# Altium schematic sheet LogicShifters_Schematic.SchDoc
size A3; SheetNumber: 2; SheetTotal: 3
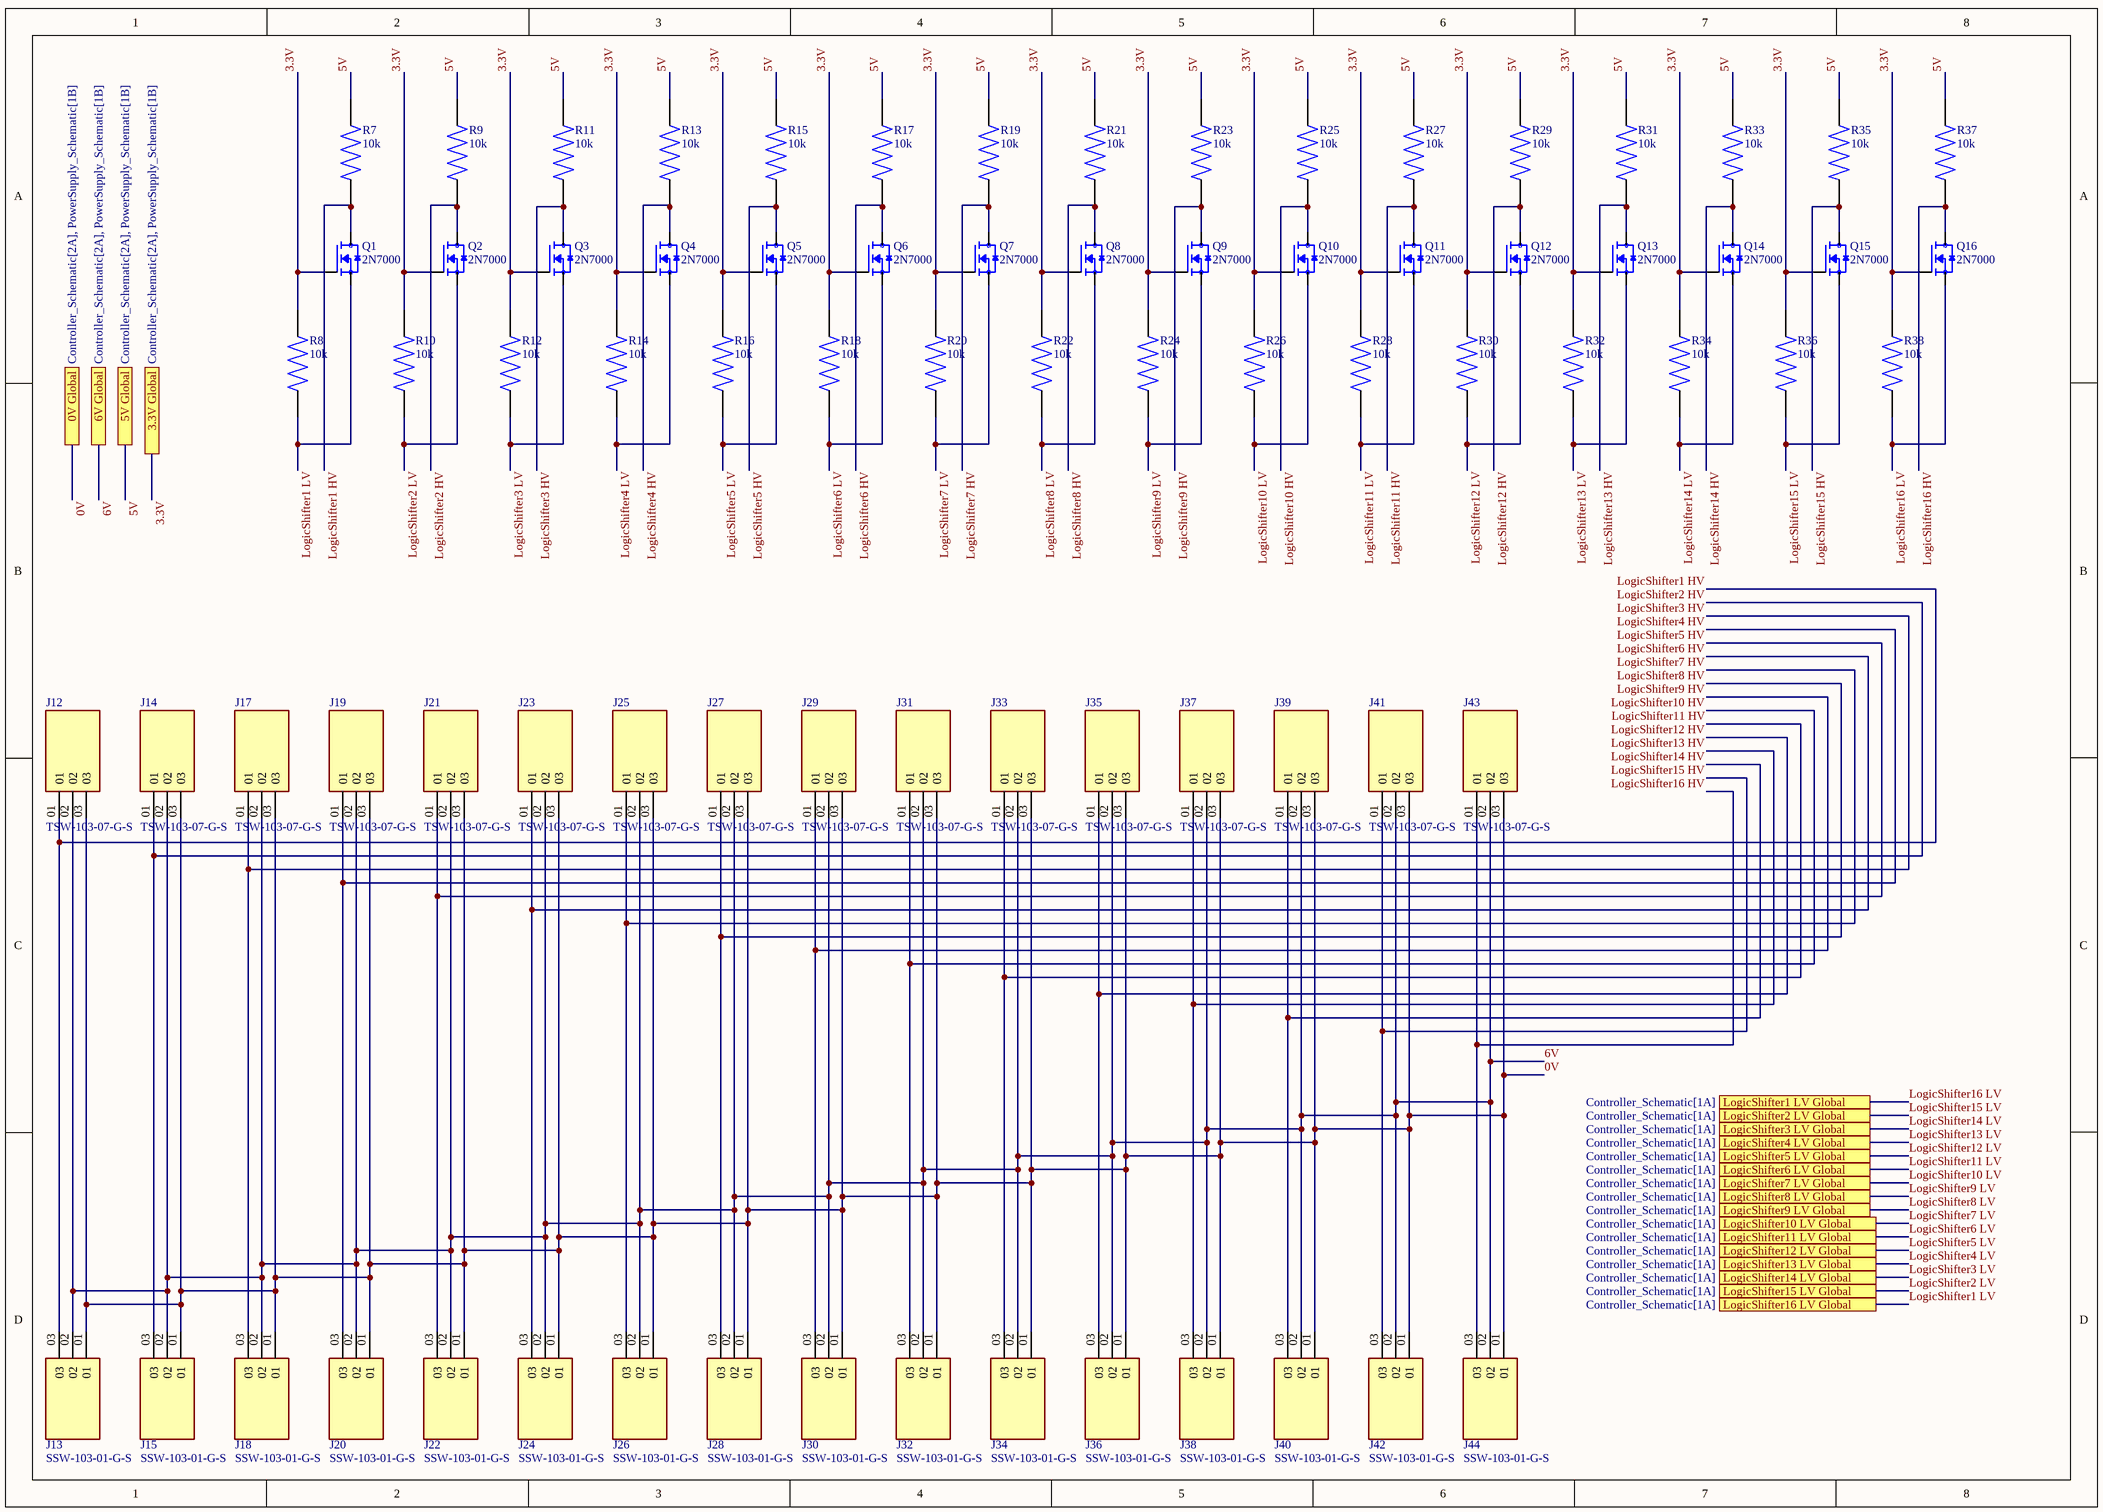
[diagram p0: LogicShifters_Schematic.SchDoc]

## Parts
J12  TSW-103-07-G-S  [SAMTEC_TSW-103-07-G-S]
J13  SSW-103-01-G-S  [SAMTEC_SSW-103-01-G-S]
J14  TSW-103-07-G-S  [SAMTEC_TSW-103-07-G-S]
J15  SSW-103-01-G-S  [SAMTEC_SSW-103-01-G-S]
J17  TSW-103-07-G-S  [SAMTEC_TSW-103-07-G-S]
J18  SSW-103-01-G-S  [SAMTEC_SSW-103-01-G-S]
J19  TSW-103-07-G-S  [SAMTEC_TSW-103-07-G-S]
J20  SSW-103-01-G-S  [SAMTEC_SSW-103-01-G-S]
J21  TSW-103-07-G-S  [SAMTEC_TSW-103-07-G-S]
J22  SSW-103-01-G-S  [SAMTEC_SSW-103-01-G-S]
J23  TSW-103-07-G-S  [SAMTEC_TSW-103-07-G-S]
J24  SSW-103-01-G-S  [SAMTEC_SSW-103-01-G-S]
J25  TSW-103-07-G-S  [SAMTEC_TSW-103-07-G-S]
J26  SSW-103-01-G-S  [SAMTEC_SSW-103-01-G-S]
J27  TSW-103-07-G-S  [SAMTEC_TSW-103-07-G-S]
J28  SSW-103-01-G-S  [SAMTEC_SSW-103-01-G-S]
J29  TSW-103-07-G-S  [SAMTEC_TSW-103-07-G-S]
J30  SSW-103-01-G-S  [SAMTEC_SSW-103-01-G-S]
J31  TSW-103-07-G-S  [SAMTEC_TSW-103-07-G-S]
J32  SSW-103-01-G-S  [SAMTEC_SSW-103-01-G-S]
J33  TSW-103-07-G-S  [SAMTEC_TSW-103-07-G-S]
J34  SSW-103-01-G-S  [SAMTEC_SSW-103-01-G-S]
J35  TSW-103-07-G-S  [SAMTEC_TSW-103-07-G-S]
J36  SSW-103-01-G-S  [SAMTEC_SSW-103-01-G-S]
J37  TSW-103-07-G-S  [SAMTEC_TSW-103-07-G-S]
J38  SSW-103-01-G-S  [SAMTEC_SSW-103-01-G-S]
J39  TSW-103-07-G-S  [SAMTEC_TSW-103-07-G-S]
J40  SSW-103-01-G-S  [SAMTEC_SSW-103-01-G-S]
J41  TSW-103-07-G-S  [SAMTEC_TSW-103-07-G-S]
J42  SSW-103-01-G-S  [SAMTEC_SSW-103-01-G-S]
J43  TSW-103-07-G-S  [SAMTEC_TSW-103-07-G-S]
J44  SSW-103-01-G-S  [SAMTEC_SSW-103-01-G-S]
Q1  2N7000  [TO92254P458H750-3]
Q2  2N7000  [TO92254P458H750-3]
Q3  2N7000  [TO92254P458H750-3]
Q4  2N7000  [TO92254P458H750-3]
Q5  2N7000  [TO92254P458H750-3]
Q6  2N7000  [TO92254P458H750-3]
Q7  2N7000  [TO92254P458H750-3]
Q8  2N7000  [TO92254P458H750-3]
Q9  2N7000  [TO92254P458H750-3]
Q10  2N7000  [TO92254P458H750-3]
Q11  2N7000  [TO92254P458H750-3]
Q12  2N7000  [TO92254P458H750-3]
Q13  2N7000  [TO92254P458H750-3]
Q14  2N7000  [TO92254P458H750-3]
Q15  2N7000  [TO92254P458H750-3]
Q16  2N7000  [TO92254P458H750-3]
R7  10k  [RESAD700W45L350D185]
R8  10k  [RESAD700W45L350D185]
R9  10k  [RESAD700W45L350D185]
R10  10k  [RESAD700W45L350D185]
R11  10k  [RESAD700W45L350D185]
R12  10k  [RESAD700W45L350D185]
R13  10k  [RESAD700W45L350D185]
R14  10k  [RESAD700W45L350D185]
R15  10k  [RESAD700W45L350D185]
R16  10k  [RESAD700W45L350D185]
R17  10k  [RESAD700W45L350D185]
R18  10k  [RESAD700W45L350D185]
R19  10k  [RESAD700W45L350D185]
R20  10k  [RESAD700W45L350D185]
R21  10k  [RESAD700W45L350D185]
R22  10k  [RESAD700W45L350D185]
R23  10k  [RESAD700W45L350D185]
R24  10k  [RESAD700W45L350D185]
R25  10k  [RESAD700W45L350D185]
R26  10k  [RESAD700W45L350D185]
R27  10k  [RESAD700W45L350D185]
R28  10k  [RESAD700W45L350D185]
R29  10k  [RESAD700W45L350D185]
R30  10k  [RESAD700W45L350D185]
R31  10k  [RESAD700W45L350D185]
R32  10k  [RESAD700W45L350D185]
R33  10k  [RESAD700W45L350D185]
R34  10k  [RESAD700W45L350D185]
R35  10k  [RESAD700W45L350D185]
R36  10k  [RESAD700W45L350D185]
R37  10k  [RESAD700W45L350D185]
R38  10k  [RESAD700W45L350D185]

## Ports
0V Global (see Controller_Schematic[2A], PowerSupply_Schematic[1B]), 3.3V Global (see Controller_Schematic[2A], PowerSupply_Schematic[1B]), 5V Global (see Controller_Schematic[2A], PowerSupply_Schematic[1B]), 6V Global (see Controller_Schematic[2A], PowerSupply_Schematic[1B]), LogicShifter1 LV Global (see Controller_Schematic[1A]), LogicShifter2 LV Global (see Controller_Schematic[1A]), LogicShifter3 LV Global (see Controller_Schematic[1A]), LogicShifter4 LV Global (see Controller_Schematic[1A]), LogicShifter5 LV Global (see Controller_Schematic[1A]), LogicShifter6 LV Global (see Controller_Schematic[1A]), LogicShifter7 LV Global (see Controller_Schematic[1A]), LogicShifter8 LV Global (see Controller_Schematic[1A]), LogicShifter9 LV Global (see Controller_Schematic[1A]), LogicShifter10 LV Global (see Controller_Schematic[1A]), LogicShifter11 LV Global (see Controller_Schematic[1A]), LogicShifter12 LV Global (see Controller_Schematic[1A]), LogicShifter13 LV Global (see Controller_Schematic[1A]), LogicShifter14 LV Global (see Controller_Schematic[1A]), LogicShifter15 LV Global (see Controller_Schematic[1A]), LogicShifter16 LV Global (see Controller_Schematic[1A])

## Nets
0V: J12.03 J13.01 J14.03 J15.01 J17.03 J18.01 J19.03 J20.01 J21.03 J22.01 J23.03 J24.01 J25.03 J26.01 J27.03 J28.01 J29.03 J30.01 J31.03 J32.01 J33.03 J34.01 J35.03 J36.01 J37.03 J38.01 J39.03 J40.01 J41.03 J42.01 J43.03 J44.01 ; port 0V Global
3.3V: Q1.2(G) Q2.2(G) Q3.2(G) Q4.2(G) Q5.2(G) Q6.2(G) Q7.2(G) Q8.2(G) Q9.2(G) Q10.2(G) Q11.2(G) Q12.2(G) Q13.2(G) Q14.2(G) Q15.2(G) Q16.2(G) R8.2 R10.2 R12.2 R14.2 R16.2 R18.2 R20.2 R22.2 R24.2 R26.2 R28.2 R30.2 R32.2 R34.2 R36.2 R38.2 ; port 3.3V Global
5V: R7.2 R9.2 R11.2 R13.2 R15.2 R17.2 R19.2 R21.2 R23.2 R25.2 R27.2 R29.2 R31.2 R33.2 R35.2 R37.2 ; port 5V Global
6V: J12.02 J13.02 J14.02 J15.02 J17.02 J18.02 J19.02 J20.02 J21.02 J22.02 J23.02 J24.02 J25.02 J26.02 J27.02 J28.02 J29.02 J30.02 J31.02 J32.02 J33.02 J34.02 J35.02 J36.02 J37.02 J38.02 J39.02 J40.02 J41.02 J42.02 J43.02 J44.02 ; port 6V Global
LogicShifter1 HV: J12.01 J13.03 Q1.3(D) R7.1
LogicShifter1 LV: Q1.1(S) R8.1 ; port LogicShifter16 LV Global
LogicShifter2 HV: J14.01 J15.03 Q2.3(D) R9.1
LogicShifter2 LV: Q2.1(S) R10.1 ; port LogicShifter15 LV Global
LogicShifter3 HV: J17.01 J18.03 Q3.3(D) R11.1
LogicShifter3 LV: Q3.1(S) R12.1 ; port LogicShifter14 LV Global
LogicShifter4 HV: J19.01 J20.03 Q4.3(D) R13.1
LogicShifter4 LV: Q4.1(S) R14.1 ; port LogicShifter13 LV Global
LogicShifter5 HV: J21.01 J22.03 Q5.3(D) R15.1
LogicShifter5 LV: Q5.1(S) R16.1 ; port LogicShifter12 LV Global
LogicShifter6 HV: J23.01 J24.03 Q6.3(D) R17.1
LogicShifter6 LV: Q6.1(S) R18.1 ; port LogicShifter11 LV Global
LogicShifter7 HV: J25.01 J26.03 Q7.3(D) R19.1
LogicShifter7 LV: Q7.1(S) R20.1 ; port LogicShifter10 LV Global
LogicShifter8 HV: J27.01 J28.03 Q8.3(D) R21.1
LogicShifter8 LV: Q8.1(S) R22.1 ; port LogicShifter9 LV Global
LogicShifter9 HV: J29.01 J30.03 Q9.3(D) R23.1
LogicShifter9 LV: Q9.1(S) R24.1 ; port LogicShifter8 LV Global
LogicShifter10 HV: J31.01 J32.03 Q10.3(D) R25.1
LogicShifter10 LV: Q10.1(S) R26.1 ; port LogicShifter7 LV Global
LogicShifter11 HV: J33.01 J34.03 Q11.3(D) R27.1
LogicShifter11 LV: Q11.1(S) R28.1 ; port LogicShifter6 LV Global
LogicShifter12 HV: J35.01 J36.03 Q12.3(D) R29.1
LogicShifter12 LV: Q12.1(S) R30.1 ; port LogicShifter5 LV Global
LogicShifter13 HV: J37.01 J38.03 Q13.3(D) R31.1
LogicShifter13 LV: Q13.1(S) R32.1 ; port LogicShifter4 LV Global
LogicShifter14 HV: J39.01 J40.03 Q14.3(D) R33.1
LogicShifter14 LV: Q14.1(S) R34.1 ; port LogicShifter3 LV Global
LogicShifter15 HV: J41.01 J42.03 Q15.3(D) R35.1
LogicShifter15 LV: Q15.1(S) R36.1 ; port LogicShifter2 LV Global
LogicShifter16 HV: J43.01 J44.03 Q16.3(D) R37.1
LogicShifter16 LV: Q16.1(S) R38.1 ; port LogicShifter1 LV Global

## Library data of the parts
J12 J14 J17 J19 J21 J23 J25 J27 J29 J31 J33 J35 J37 J39 J41 J43 = TSW-103-07-G-S: MF: Samtec; Value: *; Availability: Unavailable; Price: None; Package: None; MP: TSW-103-07-G-S
J13 J15 J18 J20 J22 J24 J26 J28 J30 J32 J34 J36 J38 J40 J42 J44 = SSW-103-01-G-S: MF: Samtec; Availability: Unavailable; Value: *; MP: SSW-103-01-G-S; Package: None; Price: None
Q1-Q16 = 2N7000: N-Channel 60 V 200mA (Ta) Through Hole TO-92; MF: NTE Electronics, Inc.; SnapEDA_Link: https://www.snapeda.com/parts/2N7000/NTE+Electronics/view-part/?ref=snap; Package: TO-226-3 NTE Electronics, Inc.; Value: *; MP: 2N7000; Check_prices: https://www.snapeda.com/parts/2N7000/NTE+Electronics/view-part/?ref=eda
R7-R38 = 3-1623927-1: 1 MOhms Â±5% 0.25W, 1/4W Through Hole Resistor Axial - Carbon Film; MF: TE Connectivity; SnapEDA_Link: https://www.snapeda.com/parts/3-1623927-1/TE+Connectivity/view-part/?ref=snap; Package: None; Value: *; MP: 3-1623927-1; Check_prices: https://www.snapeda.com/parts/3-1623927-1/TE+Connectivity/view-part/?ref=eda